# Altium schematic sheet LM334_Constant Current Source.SchDoc
size A4
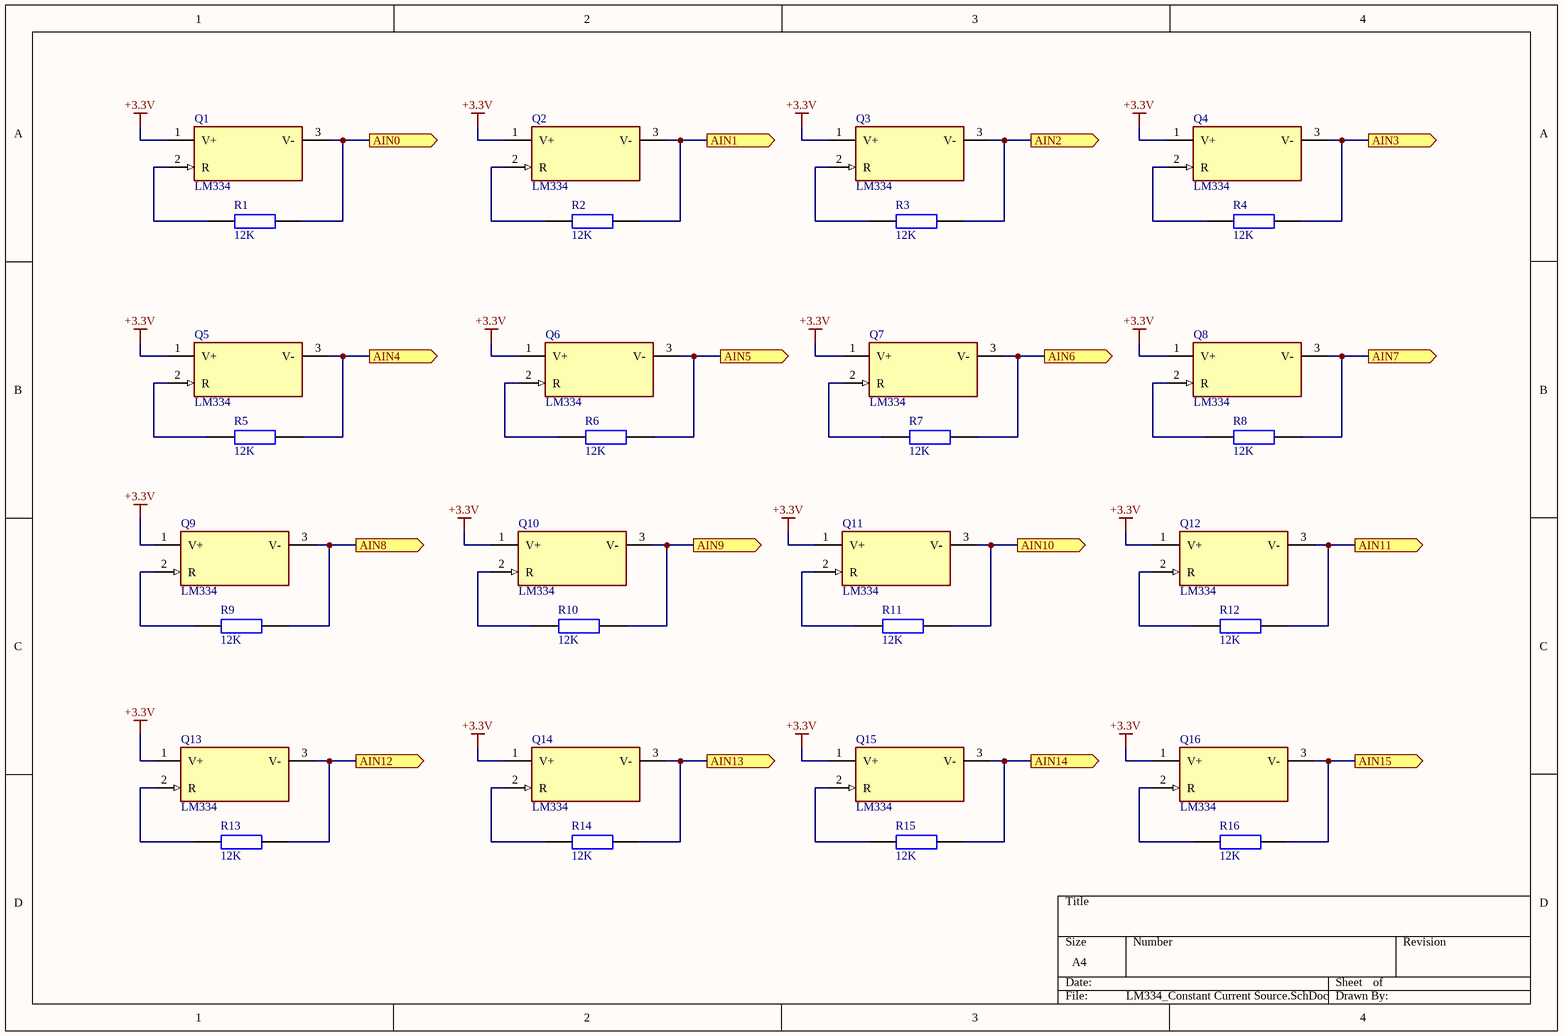
[diagram p0: LM334_Constant Current Source.SchDoc]

## Parts
Q1  LM334  [LM334_TO-92]
Q2  LM334  [LM334_TO-92]
Q3  LM334  [LM334_TO-92]
Q4  LM334  [LM334_TO-92]
Q5  LM334  [LM334_TO-92]
Q6  LM334  [LM334_TO-92]
Q7  LM334  [LM334_TO-92]
Q8  LM334  [LM334_TO-92]
Q9  LM334  [LM334_TO-92]
Q10  LM334  [LM334_TO-92]
Q11  LM334  [LM334_TO-92]
Q12  LM334  [LM334_TO-92]
Q13  LM334  [LM334_TO-92]
Q14  LM334  [LM334_TO-92]
Q15  LM334  [LM334_TO-92]
Q16  LM334  [LM334_TO-92]
R1  12K  [RESC1608X55N]
R2  12K  [RESC1608X55N]
R3  12K  [RESC1608X55N]
R4  12K  [RESC1608X55N]
R5  12K  [RESC1608X55N]
R6  12K  [RESC1608X55N]
R7  12K  [RESC1608X55N]
R8  12K  [RESC1608X55N]
R9  12K  [RESC1608X55N]
R10  12K  [RESC1608X55N]
R11  12K  [RESC1608X55N]
R12  12K  [RESC1608X55N]
R13  12K  [RESC1608X55N]
R14  12K  [RESC1608X55N]
R15  12K  [RESC1608X55N]
R16  12K  [RESC1608X55N]

## Ports
AIN0 (out), AIN1 (out), AIN2 (out), AIN3 (out), AIN4 (out), AIN5 (out), AIN6 (out), AIN7 (out), AIN8 (out), AIN9 (out), AIN10 (out), AIN11 (out), AIN12 (out), AIN13 (out), AIN14 (out), AIN15 (out)

## Nets
+3.3V: Q1.1(V+) Q2.1(V+) Q3.1(V+) Q4.1(V+) Q5.1(V+) Q6.1(V+) Q7.1(V+) Q8.1(V+) Q9.1(V+) Q10.1(V+) Q11.1(V+) Q12.1(V+) Q13.1(V+) Q14.1(V+) Q15.1(V+) Q16.1(V+)
AIN0: Q1.3(V-) R1.1 ; port AIN0
AIN1: Q2.3(V-) R2.1 ; port AIN1
AIN2: Q3.3(V-) R3.1 ; port AIN2
AIN3: Q4.3(V-) R4.1 ; port AIN3
AIN4: Q5.3(V-) R5.1 ; port AIN4
AIN5: Q6.3(V-) R6.1 ; port AIN5
AIN6: Q7.3(V-) R7.1 ; port AIN6
AIN7: Q8.3(V-) R8.1 ; port AIN7
AIN8: Q9.3(V-) R9.1 ; port AIN8
AIN9: Q10.3(V-) R10.1 ; port AIN9
AIN10: Q11.3(V-) R11.1 ; port AIN10
AIN11: Q12.3(V-) R12.1 ; port AIN11
AIN12: Q13.3(V-) R13.1 ; port AIN12
AIN13: Q14.3(V-) R14.1 ; port AIN13
AIN14: Q15.3(V-) R15.1 ; port AIN14
AIN15: Q16.3(V-) R16.1 ; port AIN15
NetQ1_2: Q1.2(R) R1.2
NetQ2_2: Q2.2(R) R2.2
NetQ3_2: Q3.2(R) R3.2
NetQ4_2: Q4.2(R) R4.2
NetQ5_2: Q5.2(R) R5.2
NetQ6_2: Q6.2(R) R6.2
NetQ7_2: Q7.2(R) R7.2
NetQ8_2: Q8.2(R) R8.2
NetQ9_2: Q9.2(R) R9.2
NetQ10_2: Q10.2(R) R10.2
NetQ11_2: Q11.2(R) R11.2
NetQ12_2: Q12.2(R) R12.2
NetQ13_2: Q13.2(R) R13.2
NetQ14_2: Q14.2(R) R14.2
NetQ15_2: Q15.2(R) R15.2
NetQ16_2: Q16.2(R) R16.2

## Library data of the parts
R1-R16 = RC0603FR-07330RL: YAGEO (PHYCOMP) - RC0603FR-0712KL - RES, THICK FILM, 12K, 1%, 0.1W, 0603
Q1-Q16 = LM334: Part Number: LM334; Footprint Doc: TO-92